# EAGLE board Open Book A1 Rev 01 (EAGLE 9.4.2)
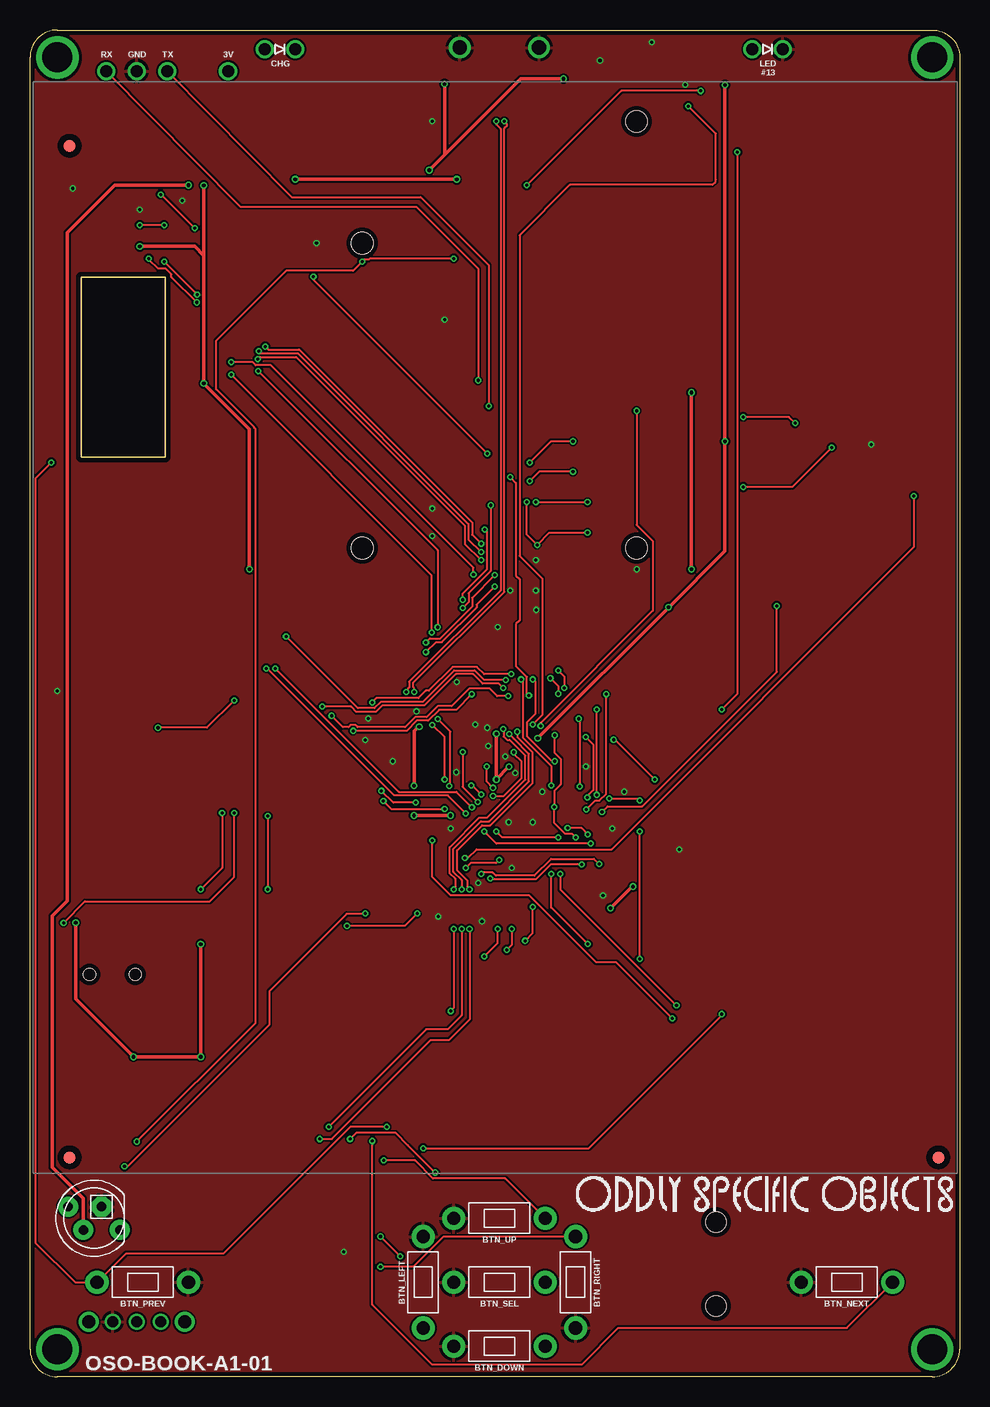
[diagram p2: board, top side]
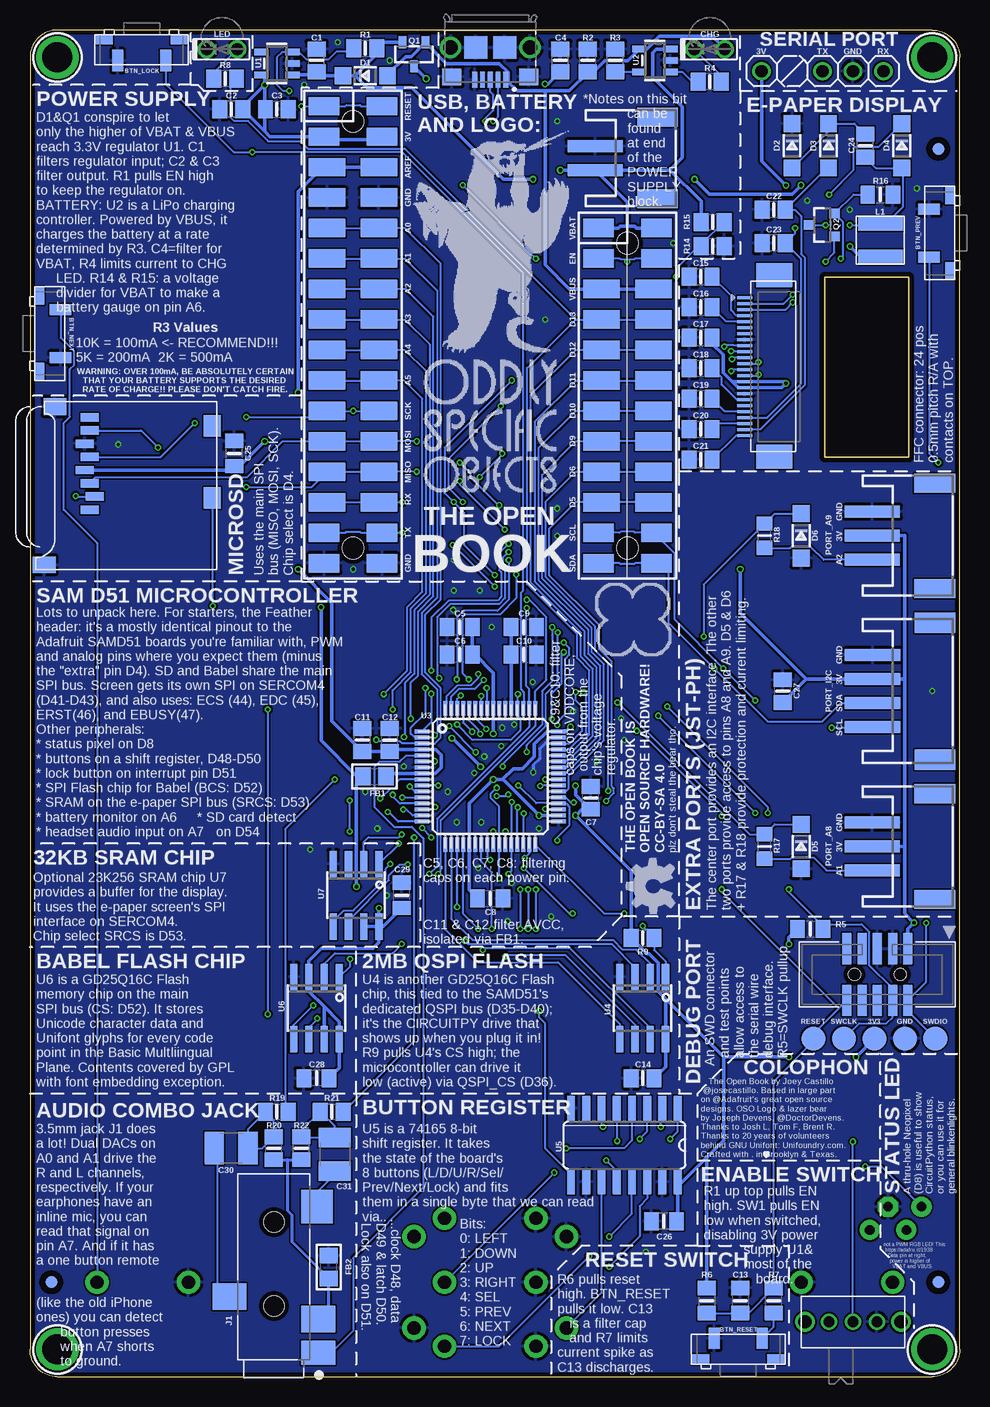
[diagram p3: board, bottom side, seen from below]

Size 77.47 x 112.27 mm. Coordinates in mm from the lower left corner, seen from the top.
Outline: 2.29,112.27 75.18,112.27 arc-90 77.47,109.98 77.47,2.29 arc-90 75.18,0 2.29,0 arc-90 0,2.29 0,109.98 arc-90 2.29,112.27
Copper layers (1*16): Top 0.035559375mm / dielectric 1.6mm / Bottom 0.035559375mm
Design rules "oshpark-2layer *": minimum track width 6mil, minimum drill 10mil, track to track 6mil, track to pad 6mil, pad to pad 6mil, via to via 6mil, smd to smd 6mil, copper to edge 15mil, drill to drill 6mil, minimum pad ring 5mil, minimum via ring 5mil, stop-mask expansion 2.5mil, vias tented up to drill 12mil, thermal gap 10mil
Net classes: 0 default: width 0.152 mm, drill 0.254 mm; 1 power: width 0.305 mm, drill 0.305 mm; 2 gnd: width 0.254 mm, drill 0.254 mm

## Footprints (pad centres in the part's own frame; a part is rotated, then mirrored left to right if it is on the bottom)
MJTP1250 = drill 1.1 pad 1.93: P$1 -2.54,0; P$2 5.08,0
TL3330AF130QG = smd 1.45 x 0.8: MP1 0.75,-2.1; MP2 7.05,-2.1 | smd 0.9 x 1.778: P$1 1.9,-0.346; P$2 5.9,-0.346
0805-NO = smd 1.24 x 1.5: 1 -0.95,0; 2 0.95,0
0805_10MGAP = smd 1.2 x 1.5: 1 -1.05,0; 2 1.05,0
C1210 = smd 1.6 x 2.7: 1 -1.4,0; 2 1.4,0
LED17X45_SIDEVIEW = drill 1: A -1.27,0; K 1.27,0
SOD-123 = smd 1.4 x 1.4: A 1.85,0; C -1.85,0
0805 = smd 1.3 x 1.5: 1 -0.95,0; 2 0.95,0
FIDUCIAL_1MM = smd 1 x 1: 1 0,0
CUI_SJ-43514-SMT = smd 2 x 2.8: 1 -7.15,-3.7 | smd 2.8 x 2.6: 2 5.05,-3.6 | smd 2.2 x 2.8: 3 -2.45,3.7; 4 -4.35,-3.7 | hole 1.7: -3.25,0; 3.75,0
FCI_10118193-0001LF = smd 0.4 x 1.35: 1 -1.3,2.675; 2 -0.65,2.675; 3 0,2.675; 4 0.65,2.675; 5 1.3,2.675 | smd 1.6 x 1.4: S1 -3.2,2.45; S2 3.2,2.45 | smd 1.9 x 1.9: S3 1.2,0; S4 -1.2,0 | drill 1.2: S5 3.302,0; S6 -3.302,0
1X03 = drill 1.016: 1 -2.54,0; 2 0,0; 3 2.54,0
1X01 = drill 1.016: 1 0,0
INDUCTOR_4X4MM_NR401 = smd 1.2 x 3.7: P$1 -1.4,0; P$2 1.4,0
MICROSD = smd 0.7 x 1.5: 1 9,-10.64; 2 7.9,-10.24; 3 6.8,-10.64; 4 5.7,-11.04; 5 4.6,-10.64; 6 3.5,-11.04; 7 2.4,-10.64; 8 1.3,-10.64 | smd 1.8 x 1.4: CD1 2,-0.44; CD2 8,-0.44 | smd 1.4 x 1.9: MT1 0.4,-13.54; MT2 13.6,-14.44
FEATHERWING_SMT2 = smd 1.524 x 2.54: 1 6.35,2.413; 1' 6.35,-2.413; 2 8.89,2.413; 2' 8.89,-2.413; 15 41.91,2.413; 15' 41.91,-2.413; 16 44.45,2.413; 16' 44.45,-2.413; 17 44.45,20.447; 17' 44.45,25.273; 18 41.91,20.447; 18' 41.91,25.273; 27 19.05,20.447; 27' 19.05,25.273; 28 16.51,20.447; 28' 16.51,25.273 | smd 1.524 x 3.048: 3 11.43,2.159; 3' 11.43,-2.159; 4 13.97,2.159; 4' 13.97,-2.159; 5 16.51,2.159; 5' 16.51,-2.159; 6 19.05,2.159; 6' 19.05,-2.159; 7 21.59,2.159; 7' 21.59,-2.159; 8 24.13,2.159; 8' 24.13,-2.159; 9 26.67,2.159; 9' 26.67,-2.159; 10 29.21,2.159; 10' 29.21,-2.159; 11 31.75,2.159; 11' 31.75,-2.159; 12 34.29,2.159; 12' 34.29,-2.159; 13 36.83,2.159; 13' 36.83,-2.159; 14 39.37,2.159; 14' 39.37,-2.159; 19 39.37,20.701; 19' 39.37,25.019; 20 36.83,20.701; 20' 36.83,25.019; 21 34.29,20.701; 21' 34.29,25.019; 22 31.75,20.701; 22' 31.75,25.019; 23 29.21,20.701; 23' 29.21,25.019; 24 26.67,20.701; 24' 26.67,25.019; 25 24.13,20.701; 25' 24.13,25.019; 26 21.59,20.701; 26' 21.59,25.019 | hole 1.8: 17.78,22.86; 43.18,22.86; 7.62,0; 43.18,0
JSTPH3 = smd 1 x 4.6: 1 -2,-2.7; 2 0,-2.7; 3 2,-2.7 | smd 1.6 x 3.4: NC1 -4.4,2.5; NC2 4.4,2.5
JSTPH4 = smd 1 x 4.6: 1 -3,-3.7; 2 -1,-3.7; 3 1,-3.7; 4 3,-3.7 | smd 1.7 x 3.4: NC1 -5.7,1.5; NC2 5.7,1.5
SOT23-R = smd 0.635 x 1.016: 1 -0.95,-1; 2 0.95,-1; 3 0,1
SOT23-3 = smd 0.8 x 0.9: 1 -0.95,-1; 2 0.95,-1; 3 0,1.1
_0805MP = smd 1.2 x 1.3: 1 -1.016,0; 2 1.016,0
LED5MMRGB = drill 0.8 pad 1.676: 1 -2.159,0.968; 3 0.889,0.968; 4 2.159,-0.968 | drill 0.8 pad 1.676 octagon: 2 -0.635,-0.968
A10767 = drill 1.1: MP1 -4,0; MP2 4,0 | drill 0.9: P$1 -2,0; P$2 0,0; P$3 2,0
TESTPOINT_ROUND_2MM_NO = smd 2 x 2: P$1 0,0
SOT23-5 = smd 0.55 x 1.2: 1 -0.95,-1.3; 2 0,-1.3; 3 0.95,-1.3; 4 0.95,1.3; 5 -0.95,1.3
TQFP64-10X10 = smd 1.2 x 0.3: 1 -5.7,3.75; 2 -5.7,3.25; 3 -5.7,2.75; 4 -5.7,2.25; 5 -5.7,1.75; 6 -5.7,1.25; 7 -5.7,0.75; 8 -5.7,0.25; 9 -5.7,-0.25; 10 -5.7,-0.75; 11 -5.7,-1.25; 12 -5.7,-1.75; 13 -5.7,-2.25; 14 -5.7,-2.75; 15 -5.7,-3.25; 16 -5.7,-3.75; 33 5.7,-3.75; 34 5.7,-3.25; 35 5.7,-2.75; 36 5.7,-2.25; 37 5.7,-1.75; 38 5.7,-1.25; 39 5.7,-0.75; 40 5.7,-0.25; 41 5.7,0.25; 42 5.7,0.75; 43 5.7,1.25; 44 5.7,1.75; 45 5.7,2.25; 46 5.7,2.75; 47 5.7,3.25; 48 5.7,3.75 | smd 0.3 x 1.2: 17 -3.75,-5.7; 18 -3.25,-5.7; 19 -2.75,-5.7; 20 -2.25,-5.7; 21 -1.75,-5.7; 22 -1.25,-5.7; 23 -0.75,-5.7; 24 -0.25,-5.7; 25 0.25,-5.7; 26 0.75,-5.7; 27 1.25,-5.7; 28 1.75,-5.7; 29 2.25,-5.7; 30 2.75,-5.7; 31 3.25,-5.7; 32 3.75,-5.7; 49 3.75,5.7; 50 3.25,5.7; 51 2.75,5.7; 52 2.25,5.7; 53 1.75,5.7; 54 1.25,5.7; 55 0.75,5.7; 56 0.25,5.7; 57 -0.25,5.7; 58 -0.75,5.7; 59 -1.25,5.7; 60 -1.75,5.7; 61 -2.25,5.7; 62 -2.75,5.7; 63 -3.25,5.7; 64 -3.75,5.7
SOIC8_150MIL = smd 0.6 x 2.2: 1 -1.905,-2.6; 2 -0.635,-2.6; 3 0.635,-2.6; 4 1.905,-2.6; 5 1.905,2.6; 6 0.635,2.6; 7 -0.635,2.6; 8 -1.905,2.6
SO16 = smd 0.66 x 2.032: 1 -4.445,-3.073; 2 -3.175,-3.073; 3 -1.905,-3.073; 4 -0.635,-3.073; 5 0.635,-3.073; 6 1.905,-3.073; 7 3.175,-3.073; 8 4.445,-3.073; 9 4.445,3.073; 10 3.175,3.073; 11 1.905,3.073; 12 0.635,3.073; 13 -0.635,3.073; 14 -1.905,3.073; 15 -3.175,3.073; 16 -4.445,3.073
MICROBUILDER_SOIC8_150MIL = smd 0.6 x 2.2: 1 -1.905,-2.6; 2 -0.635,-2.6; 3 0.635,-2.6; 4 1.905,-2.6; 5 1.905,2.6; 6 0.635,2.6; 7 -0.635,2.6; 8 -1.905,2.6
MOUNTINGHOLE_2.5_PLATED = drill 2.5 pad 3.2: P$1 0,0
EINK_DISPLAY_4_2IN = smd 1.25 x 0.275 bottom: 1 17.653,-16.717; 2 17.653,-17.217; 3 17.653,-17.717; 4 17.653,-18.217; 5 17.653,-18.717; 6 17.653,-19.217; 7 17.653,-19.717; 8 17.653,-20.217; 9 17.653,-20.717; 10 17.653,-21.217; 11 17.653,-21.717; 12 17.653,-22.217; 13 17.653,-22.717; 14 17.653,-23.217; 15 17.653,-23.717; 16 17.653,-24.217; 17 17.653,-24.717; 18 17.653,-25.217; 19 17.653,-25.717; 20 17.653,-26.217; 21 17.653,-26.717; 22 17.653,-27.217; 23 17.653,-27.717; 24 17.653,-28.217 | smd 3 x 2 bottom: SPRT1 15.193,-14.867; SPRT2 15.193,-29.977
JSTPH2 = smd 1 x 4.6: 1 -1,-3.7; 2 1,-3.7 | smd 1.6 x 3.4: NC1 -3.4,1.5; NC2 3.4,1.5
2X05_1.27MM_BOX_POSTS = smd 0.76 x 2.6: 1 -2.54,-2.15; 2 -2.54,2.15; 3 -1.27,-2.15; 4 -1.27,2.15; 5 0,-2.15; 6 0,2.15; 7 1.27,-2.15; 8 1.27,2.15; 9 2.54,-2.15; 10 2.54,2.15 | hole 1: -1.905,0; 1.905,0

## Placement (x,y rotation side)
BTN_DOWN  MJTP1250_SPST_SWITCH  [MJTP1250]  40.39,2.54 180 top
BTN_LEFT  MJTP1250_SPST_SWITCH  [MJTP1250]  32.77,6.6 90 top
BTN_LOCK  SPST_TACTILE_SWITCHRA  [TL3330AF130QG]  64.26,109.37 180 bottom
BTN_NEXT  MJTP1250_SPST_SWITCH  [MJTP1250]  69.34,7.87 180 top
BTN_NEXT_ALT  SPST_TACTILE_SWITCHRA  [TL3330AF130QG]  74.57,90.86 270 bottom
BTN_PREV  MJTP1250_SPST_SWITCH  [MJTP1250]  8.13,7.87 0 top
BTN_PREV_ALT  SPST_TACTILE_SWITCHRA  [TL3330AF130QG]  2.9,91.44 90 bottom
BTN_RESET  SPST_TACTILE_SWITCHRA  [TL3330AF130QG]  22.35,3.56 0 bottom
BTN_RIGHT  MJTP1250_SPST_SWITCH  [MJTP1250]  45.47,9.14 270 top
BTN_SEL  MJTP1250_SPST_SWITCH  [MJTP1250]  40.39,7.87 180 top
BTN_UP  MJTP1250_SPST_SWITCH  [MJTP1250]  40.39,13.21 180 top
C1  10µF  [0805-NO]  53.59,109.73 90 bottom
C2  10µF  [0805-NO]  60.71,105.66 180 bottom
C3  1uF  [0805-NO]  56.9,105.66 0 bottom
C4  10µF  [0805-NO]  33.27,109.73 90 bottom
C5  10uF  [0805_10MGAP]  41.66,62.48 180 bottom
C6  1uF  [0805_10MGAP]  41.66,60.2 180 bottom
C7  1uF  [0805-NO]  30.73,48.26 90 bottom
C8  1uF  [0805_10MGAP]  39.12,39.88 0 bottom
C9  10uF  [0805_10MGAP]  36.32,62.48 0 bottom
C10  1uF  [0805_10MGAP]  36.32,60.2 0 bottom
C11  10µF  [0805-NO]  49.78,53.09 90 bottom
C12  1uF  [0805-NO]  47.5,53.09 90 bottom
C13  0.1uF  [0805_10MGAP]  18.29,6.35 270 bottom
C14  1uF  [0805-NO]  26.42,24.89 180 bottom
C15  1uF  [0805-NO]  21.59,91.69 0 bottom
C16  1uF  [0805-NO]  21.59,89.15 0 bottom
C17  1uF  [0805-NO]  21.59,86.61 0 bottom
C18  1uF/25V  [0805-NO]  21.59,84.07 0 bottom
C19  1uF/25V  [0805-NO]  21.59,81.53 0 bottom
C20  1uF/25V  [0805-NO]  21.59,78.99 0 bottom
C21  1uF/25V  [0805-NO]  21.59,76.45 0 bottom
C22  1uF/25V  [0805-NO]  15.49,97.28 180 bottom
C23  1uF/25V  [0805-NO]  15.49,94.49 180 bottom
C24  4.7uF/25V  [0805-NO]  7.87,102.62 90 bottom
C25  10uF  [0805_10MGAP]  60.45,76.96 90 bottom
C26  1uF  [0805_10MGAP]  24.64,12.95 180 bottom
C27  10uF  [0805-NO]  14.73,57.15 90 bottom
C28  1uF  [0805_10MGAP]  53.59,24.89 180 bottom
C29  1uF  [0805_10MGAP]  46.48,40.13 90 bottom
C30  100uF  [C1210]  60.71,19.05 180 bottom
C31  100uF  [C1210]  52.07,18.54 270 bottom
CHG  AMBER  [LED17X45_SIDEVIEW]  20.83,110.67 180 bottom
D1  MBR120  [SOD-123]  49.53,108.46 0 bottom
D2  MBR0530  [SOD-123]  13.97,102.62 270 bottom
D3  MBR0530  [SOD-123]  10.92,102.62 270 bottom
D4  MBR0530  [SOD-123]  4.83,102.62 270 bottom
D5  3.6V  [SOD-123]  13.21,44.2 270 bottom
D6  3.6V  [SOD-123]  13.21,70.1 270 bottom
FB1  Ferrite  [0805]  48.77,50.04 0 bottom
FB2  Ferrite  [0805]  52.58,9.14 90 bottom
FID1  FIDUCIAL_1MM  [FIDUCIAL_1MM]  75.69,7.87 0 bottom
FID2  FIDUCIAL_1MM  [FIDUCIAL_1MM]  75.69,18.29 0 top
FID3  FIDUCIAL_1MM  [FIDUCIAL_1MM]  1.78,102.36 0 bottom
FID4  FIDUCIAL_1MM  [FIDUCIAL_1MM]  3.3,102.62 0 top
FID5  FIDUCIAL_1MM  [FIDUCIAL_1MM]  1.78,7.87 0 bottom
FID6  FIDUCIAL_1MM  [FIDUCIAL_1MM]  3.3,18.29 0 top
GOLD_ORB_SM1  OSHWLOGOLOGO5MM  [OSHW_5MM]  25.53,40.89 90 bottom
J1  SJ-43514-SMT  [CUI_SJ-43514-SMT]  57.15,9.14 90 bottom
J2  10118193-0001LF  [FCI_10118193-0001LF]  39.12,110.81 180 bottom
JP1  [1X03]  8.89,108.84 0 bottom
JP2  [1X01]  16.51,108.84 0 bottom
L1  68uH  [INDUCTOR_4X4MM_NR401]  6.6,94.74 270 bottom
LED  RED OR GRN  [LED17X45_SIDEVIEW]  61.47,110.67 180 bottom
MICROSD  MICROSD  [MICROSD]  61.85,81.28 270 bottom
MS1  FEATHERWING_SMTDUAL  [FEATHERWING_SMT2]  50.55,112.27 270 bottom
PORT_A8  JST PH 3  [JSTPH3]  4.57,44.2 270 bottom
PORT_A9  JST PH 3  [JSTPH3]  4.57,70.1 270 bottom
PORT_I2C  JST PH 4  [JSTPH4]  3.56,57.15 270 bottom
Q1  DMG341  [SOT23-R]  45.47,110.24 180 bottom
Q2  IRLML0100  [SOT23-3]  11.43,96.01 90 bottom
R1  10K  [0805-NO]  49.53,110.74 0 bottom
R2  100K  [0805-NO]  30.99,109.73 90 bottom
R3  10K\  [0805-NO]  28.7,109.73 90 bottom
R4  1K  [0805-NO]  20.83,107.95 180 bottom
R5  10K  [0805_10MGAP]  12.45,37.34 0 bottom
R6  10K  [0805_10MGAP]  21.08,6.35 270 bottom
R7  100  [0805_10MGAP]  15.49,6.35 90 bottom
R8  2.2K  [0805-NO]  61.21,108.2 180 bottom
R9  100K  [0805-NO]  26.42,36.58 0 bottom
R14  100K  [0805-NO]  20.57,94.23 0 bottom
R15  100K  [0805-NO]  20.57,96.27 0 bottom
R16  0.47ohm  [0805_10MGAP]  6.6,98.55 0 bottom
R17  1K  [_0805MP]  16.26,44.2 90 bottom
R18  1K  [_0805MP]  16.26,70.1 90 bottom
R19  100  [0805-NO]  56.9,22.1 0 bottom
R20  100  [0805-NO]  57.15,19.05 90 bottom
R21  100  [0805-NO]  52.32,22.1 0 bottom
R22  100  [0805-NO]  54.86,19.05 90 bottom
STATUS  WS2812B  [LED5MMRGB]  5.33,13.21 180 top
SW1  SPDT_SWITCH  [A10767]  8.89,4.57 0 bottom
TP1  [TESTPOINT_ROUND_2MM_NO]  4.57,28.19 180 bottom
TP2  [TESTPOINT_ROUND_2MM_NO]  7.11,28.19 180 bottom
TP6  [TESTPOINT_ROUND_2MM_NO]  9.65,28.19 180 bottom
TP7  [TESTPOINT_ROUND_2MM_NO]  2.03,28.19 180 bottom
TP8  [TESTPOINT_ROUND_2MM_NO]  12.19,28.19 180 bottom
U1  AP2112-3.3  [SOT23-5]  56.9,109.47 90 bottom
U2  MCP73831T-2ACI/OT  [SOT23-5]  25.4,109.73 90 bottom
U3  ATSAMD51J64-TQFP(10X10)  [TQFP64-10X10]  39.12,50.04 0 bottom
U4  GD25Q16C (or GD25Q32C)  [SOIC8_150MIL]  26.42,30.73 180 bottom
U5  74AC165D  [SO16]  27.94,19.3 180 bottom
U6  GD25Q16C (or GD25Q32C)  [MICROBUILDER_SOIC8_150MIL]  53.59,30.73 180 bottom
U7  23K256-I/SN  [SOIC8_150MIL]  50.29,40.13 180 bottom
U$1  MOUNTINGHOLE2.5  [MOUNTINGHOLE_2.5_PLATED]  2.29,2.29 0 bottom
U$2  WAVESHARE_4_2_INCH_EINK_DISPLAY  [EINK_DISPLAY_4_2IN]  0.25,106.68 0 top
U$4  MOUNTINGHOLE2.5  [MOUNTINGHOLE_2.5_PLATED]  75.18,2.29 0 bottom
U$5  MOUNTINGHOLE2.5  [MOUNTINGHOLE_2.5_PLATED]  2.29,109.98 0 bottom
U$7  MOUNTINGHOLE2.5  [MOUNTINGHOLE_2.5_PLATED]  75.18,109.98 0 bottom
U$44  OSO_GRAPHIC  [OSO_GRAPHIC]  27.18,63.12 0 bottom
U$45  OSO_BEAR  [OSO_BEAR_750MIL]  38.86,94.23 0 bottom
U$47  OSO_TEXT  [OSO_TEXT_435MIL]  39.12,78.82 0 bottom
U$48  OSO_TEXTOSO_TEXT_ONELINE_125MIL  [OSO_ONELINE_125MIL]  45.47,15.24 0 top
X1  JSTPH  [JSTPH2]  26.67,101.6 270 bottom
X2  2x5 0.05" SWD  [2X05_1.27MM_BOX_POSTS]  6.86,33.53 180 bottom

## Tracks (layer width: path | path; a pad name or v marks a point on that pad's centre or on a via)
!RESET  (via drill 0.25)
  Top 0.152: v41.88,54.36 42.67,55.14 42.67,66.55 40.79,68.43 40.79,95.15 45,99.35 56.86,99.35 57.14,99.64 57.14,99.81 57.15,99.82 57.15,103.63 v54.86,105.92 | v36.81,56.9 35.51,55.6 34.09,55.6 33.17,54.69 32.23,54.69 31.39,53.85 v26.92,53.85 | v19.81,46.74 v19.81,40.64
  Bottom 0.152: MS1.1 49.9,105.92 49.98,106 51.11,106 51.2,105.92 MS1.1' v54.86,105.92 | R6.2 C13.2 17.59,5.3 R7.2 15.49,24.64 12.19,27.94 TP8.P$1 12.19,28.58 X2.10 10.08,30.7 19.81,40.43 v19.81,40.64 | v41.88,54.36 40.61,53.09 37.41,53.09 36.63,53.87 36.63,54.91 36.87,55.15 U3.52 36.81,55.8 v36.81,56.9 | v26.92,53.85 26.67,53.85 19.81,46.99 v19.81,46.74
+3V3  (via drill 0.3)
  Top 0.305: v57.91,107.7 v57.91,77.98 57.91,68.83 v53.21,64.14 v42.32,53.24 | v14.22,36.07 v14.22,26.67 v8.64,26.67 3.81,31.5 v3.81,37.85 | v18.29,67.31 18.29,78.99 v14.48,82.8 14.48,93.47 | v9.14,94.23 13.72,94.23 14.48,93.47 | v39.91,50.86 38.86,49.81 v38.86,49.78 v38.86,53.59 | v32.44,54.18 32.33,54.18 32,53.85 v32,49.28 | v50.26,40.86 50.19,40.86 v48.39,39.06 | v32,46.79 v35.05,46.79 | v14.48,99.31 14.48,93.47
  Bottom 0.305: U1.5 57.91,108.24 v57.91,107.7 | v57.91,77.98 59.98,75.91 C25.1 60.78,75.58 MICROSD.4 | v38.86,53.59 U3.56 38.87,58.68 40.39,60.2 C6.1 C5.1 | U3.34 v35.05,46.79 38.05,49.78 38.1,49.78 | v53.21,64.14 53.21,53.02 50.23,50.04 FB1.1 49.72,49.84 50.26,49.29 v50.26,40.86 | 52.96,30.86 54.23,32.13 U6.3 54.23,34.67 53.21,35.69 48.89,35.69 48.39,36.2 U7.8 | 52.96,30.86 51.69,29.59 U6.8 51.69,25.75 C28.1 | U6.7 52.96,30.86 | 24.51,31.5 U4.8 24.51,25.85 C14.1 | 24.51,31.5 25.12,32.11 25.12,34.5 25.86,35.25 26.04,35.25 R9.1 27.37,42.15 v32,46.79 31.95,46.79 31.43,47.31 C7.1 30.8,47.31 32,48.51 v32,49.28 | 19.68,26.67 v14.22,26.67 | TP2.P$1 v8.64,26.67 | 24.51,31.5 19.68,26.67 | R5.1 14.22,36.61 v14.22,36.07 | X2.1 4.32,37.34 v3.81,37.85 4.59,38.62 4.59,44.2 | 4.59,44.2 4.59,58.17 | 4.59,58.17 4.59,70.1 PORT_A9.2 | C27.1 12.78,58.15 | 12.78,58.15 PORT_I2C.2 7.24,58.17 4.59,58.17 | PORT_A8.2 4.59,44.2 | 12.78,58.15 18.29,63.66 v18.29,67.31 | 18.96,82.96 18.46,82.46 U$2.16 14.82,82.46 v14.48,82.8 14.64,82.96 U$2.15 18.96,82.96 | C17.2 20.64,86.13 19.7,85.19 19.7,83.71 18.96,82.96 | v9.14,94.23 8.25,93.34 L1.P$2 | U7.8 v48.39,39.06 | U7.8 48.03,37.53 C29.1 | U7.7 U7.8 | v42.32,53.24 42.29,53.24 v39.91,50.86 | 38.1,49.78 37.21,50.67 36.45,50.67 35.43,51.69 35.43,52.73 34.38,53.79 U3.48 32.83,53.79 v32.44,54.18 | 19.68,26.67 19.68,19.69 21.08,18.29 | R6.1 21.08,18.29 | 38.1,49.78 v38.86,49.78 40.87,47.78 U3.21 40.87,40.58 C8.1 | JP2.1 16.51,101.35 v14.48,99.31 | v57.91,107.7 59.76,105.85 C2.1 57.91,103.82 | v57.91,107.7 57.91,105.73 | 57.91,105.73 C3.1 | 57.91,105.73 57.91,103.82 | U5.16 23.5,15.88 | 21.08,18.29 23.5,15.88
  Bottom 0.305: MS1.2 48.39,103.12 52.7,103.12 MS1.2' 57.47,103.38 57.91,103.82 | 23.5,15.88 23.5,13.05 C26.1
A0  (via drill 0.25)
  Top 0.152: v52.07,49.78 48.75,53.1 v48.63,53.1
  Bottom 0.152: MS1.5' MS1.5 46.23,95.76 43.24,92.78 43.24,64.81 44.52,63.53 44.52,58.69 43.24,57.42 43.24,53.27 43.73,52.79 U3.3 44.77,52.83 46.5,52.83 46.65,52.98 48.51,52.98 v48.63,53.1 | R19.2 56.2,22.35 56.2,45.65 v52.07,49.78
A1  (via drill 0.25)
  Top 0.152: v43.73,53.48 43.69,53.44 43.69,52.04 44.22,51.51 44.22,49.38 43.69,48.85 v43.69,47.5 43.69,46.16 44.59,45.25 45.17,45.25 v45.47,44.96
  Bottom 0.152: MS1.6' MS1.6 46.23,93.22 43.55,90.54 43.55,64.94 44.83,63.66 44.83,58.57 43.55,57.29 43.55,53.65 v43.73,53.48 | v43.69,47.5 43.9,47.29 U3.14 | R21.2 45.47,28.01 v45.47,44.96
A2  (via drill 0.25)
  Top 0.152: v45.73,54.85 45.82,54.76 v45.82,49.2
  Bottom 0.152: MS1.7' MS1.7 46.14,90.68 43.85,88.39 43.85,65.06 45.13,63.78 45.13,58.48 45.73,57.87 v45.73,54.85 | U3.11 45.41,48.79 v45.82,49.2
A3  (via drill 0.25)
  Top 0.152: v46.3,53.34 46.94,52.7 46.94,48.9 46.46,48.41 v46.46,48.28
  Bottom 0.152: MS1.8' MS1.8 46.23,88.14 44.16,86.07 44.16,65.19 45.44,63.91 45.44,58.6 46.23,57.81 46.23,53.42 v46.3,53.34 | v46.46,48.28 U3.12
A4  (via drill 0.25)
  Top 0.152: v47.24,48.51 v47.24,55.63
  Bottom 0.152: MS1.9' MS1.9 46.24,85.6 44.46,83.82 44.46,65.31 45.74,64.04 45.74,58.73 47.24,57.23 v47.24,55.63 | U3.13 46.64,47.79 47.24,48.39 v47.24,48.51
A5  (via drill 0.25)
  Top 0.152: v46.37,47.3 47.09,48.03 47.44,48.03 48.01,48.59 v48.01,56.9
  Bottom 0.152: MS1.10' MS1.10 46.29,83.06 44.77,81.53 44.77,65.44 46.04,64.16 46.04,58.86 v48.01,56.9 | U3.15 45.58,46.79 46.09,47.3 v46.37,47.3
A6_VMEAS  (via drill 0.25)
  Top 0.152: v41.58,56.8 41.4,56.98 41.4,58.34 40.49,59.26 40.49,62.74 40.79,63.04 40.79,66.5 40.49,66.8 40.49,74.5 v40,74.98 | v38.12,76.96 23.62,91.46 v23.62,91.69
  Bottom 0.152: U3.62 41.87,56.51 v41.58,56.8 | v40,74.98 38.12,76.87 v38.12,76.96 | v23.62,91.69 23.62,92.39 21.78,94.23 R14.1 21.52,94.41 19.67,96.27 R15.2
A7_MIC
  Bottom 0.152: J1.1 52.36,1.99 50.55,3.81 50.55,9.91 44.68,15.77 44.68,44.88 45.64,45.85 47.12,45.85 48.77,47.5 48.77,50.81 48.31,51.27 46.65,51.27 46.13,51.79 U3.5
A8_
  Bottom 0.152: R17.1 14.1,43.18 14,43.27 12.16,43.27 11.08,42.2 PORT_A8.3
A9_
  Bottom 0.152: R18.1 14.1,69.09 14,69.18 12.41,69.18 11.33,68.1 PORT_A9.3
AGND
  Bottom 0.254: R20.1 56.01,18.1 | 56.01,18.1 R22.1 | J1.4 52.58,5.67 FB2.1 55.63,11.24 55.63,13.46 56.01,13.84 56.01,18.1
AUDIO_LEFT
  Bottom 0.152: J1.2 53.55,15.41 52.07,16.89 C31.2
AUDIO_RIGHT
  Bottom 0.152: C30.2 61.87,18.81 61.87,7.71 J1.3
AVCC  (via drill 0.3)
  Top 0.305: v55.12,67.31 v55.12,82.04
  Bottom 0.305: FB1.2 47.57,50.29 U3.8 43.69,50.29 43.18,50.8 43.18,51.82 43.65,52.29 U3.4 47.35,52.29 C12.1 C11.1 52.32,54.68 52.32,64.52 v55.12,67.31 | MS1.3 MS1.3' 53.09,100.84 55.12,98.81 v55.12,82.04
BUTTON0
  Bottom 0.152: U5.11 29.85,6.99 BTN_LEFT.P$1
BUTTON1  (via drill 0.25)
  Top 0.152: BTN_UP.P$1 39.6,16.54 33.58,16.54 32.08,18.03 v29.46,18.03
  Bottom 0.152: v29.46,18.03 28.58,17.14 U5.12
BUTTON2  (via drill 0.25)
  Top 0.152: v30.86,10.03 v29.21,11.68
  Bottom 0.152: BTN_DOWN.P$1 38.35,2.54 v30.86,10.03 | v29.21,11.68 27.3,13.59 U5.13
BUTTON3  (via drill 0.25)
  Top 0.152: BTN_RIGHT.P$1 34.45,11.68 31.94,9.17 v29.21,9.17
  Bottom 0.152: U5.14 26.04,14.86 26.67,14.22 26.67,11.71 v29.21,9.17
BUTTON4  (via drill 0.25)
  Top 0.152: v33.78,17.02 31.5,19.3 30.48,20.32 27.18,20.32 v26.67,19.81
  Bottom 0.152: BTN_SEL.P$1 v33.78,17.02 | v26.67,19.81 26.04,20.45 U5.3
BUTTON5  (via drill 0.25)
  Top 0.152: v58.95,102.08 58.95,56.92 v57.66,55.63 | v57.66,30.23 57.66,30.14 46.57,19.05 v32.77,19.05
  Bottom 0.152: U3.51 36.32,55.78 36.32,57.1 36.54,57.31 36.54,65.36 36.37,65.53 36.37,91.99 46.46,102.08 v58.95,102.08 60.48,102.08 66.16,107.76 BTN_LOCK.P$1 | v57.66,55.63 v57.66,30.23 | U5.4 27.3,19.68 27.94,19.05 v32.77,19.05
BUTTON6  (via drill 0.25)
  Top 0.152: BTN_NEXT.P$1 68.07,4.06 49.02,4.06 45.97,1.02 33.53,1.02 28.54,6.01 v28.54,19.64
  Bottom 0.152: BTN_NEXT_ALT.P$1 74.92,86.62 73.8,85.5 73.8,84.33 74.14,83.99 74.14,80.01 74.68,79.48 74.68,72.28 71.88,69.49 BTN_NEXT.P$1 | v28.54,19.64 28.54,22.34 U5.5
BUTTON7  (via drill 0.25)
  Top 0.152: v1.78,76.2 0.46,74.88 0.46,11.18 3.76,7.87 BTN_PREV.P$1 8,10.29 16.13,10.29 26.67,20.83 v29.72,20.83
  Bottom 0.152: BTN_PREV_ALT.P$1 2.55,76.97 v1.78,76.2 | U5.6 29.85,20.95 v29.72,20.83
BUTTON_CLK  (via drill 0.25)
  Top 0.152: v39.95,53.57 40.31,53.21 40.31,53.19 41.58,51.91 41.58,49.63 38.25,46.3 37.57,46.3 35.28,44.01 35.28,42.09 35.97,41.41 v35.97,40.62 | v35.97,37.34 35.97,30.12 34.8,28.96 33.02,28.96 v24.89,20.83
  Bottom 0.152: U3.60 40.87,54.7 40.13,53.97 40.13,53.75 v39.95,53.57 | v35.97,40.62 v35.97,37.34 | v24.89,20.83 24.89,22.25 U5.2
BUTTON_LATCH  (via drill 0.25)
  Top 0.152: v40.61,53.77 40.61,53.31 41.88,52.04 41.88,49.51 38.35,45.97 37.67,45.97 35.59,43.89 35.59,42.22 36.45,41.35 36.45,40.79 v36.63,40.62 | v36.63,37.34 36.63,29.77 34.92,28.07 33.4,28.07 25.15,19.81 v24.13,19.81
  Bottom 0.152: U3.61 41.37,54.52 v40.61,53.77 | v36.63,40.62 v36.63,37.34 | v24.13,19.81 23.5,20.45 U5.1
BUTTON_OUT  (via drill 0.25)
  Top 0.152: v39.44,53.99 39.47,53.95 39.47,53.37 39.75,53.09 39.98,53.09 41.27,51.79 41.27,49.78 38.1,46.61 37.44,46.61 34.98,44.14 34.98,41.97 35.42,41.52 35.42,40.73 v35.31,40.62 | v35.31,37.34 35.31,30.73 v35.05,30.48
  Bottom 0.152: U3.59 40.37,54.91 v39.44,53.99 | v35.05,30.48 35.05,29.97 34.54,29.46 34.54,19.05 32.38,16.89 U5.9 | v35.31,40.62 v35.31,37.34
D2_A8  (via drill 0.25)
  Top 0.152: v40.11,58.57 37.85,58.57 37.24,59.18 35.23,59.18 33.23,57.19 32.98,57.19 32.37,56.58 28.87,56.58 v28.51,56.22
  Bottom 0.152: v40.11,58.57 40.11,58.27 40.72,57.66 41.83,57.66 42.74,56.75 42.74,55.86 U3.64 | v28.51,56.22 17.5,45.21 R17.2 15.42,46.05 D5.C
D3_A9  (via drill 0.25)
  Top 0.152: v39.65,58.09 37.85,58.09 37.06,58.88 35.35,58.88 32.74,56.26 29.23,56.26 28.7,55.73 27.33,55.73 v21.34,61.72
  Bottom 0.152: D6.C 15.42,71.95 R18.2 21.34,66.04 v21.34,61.72 | v39.65,58.09 40.39,57.35 41.71,57.35 42.37,56.69 U3.63
D5  (via drill 0.25)
  Top 0.152: v29.46,48 30.16,47.3 34.49,47.3 v34.54,47.35
  Bottom 0.152: MS1.19' MS1.19 32,72.9 34.19,70.71 34.19,66.8 30.05,62.66 30.05,60.66 29.01,59.62 29.01,49.25 28.81,49.05 28.81,48.65 v29.46,48 | U3.35 34.48,47.29 v34.54,47.35
D6  (via drill 0.25)
  Top 0.152: v32.14,47.87 30.27,47.87 v29.29,48.85
  Bottom 0.152: MS1.20' MS1.20 32,75.44 34.49,72.95 34.49,66.68 30.35,62.54 30.35,60.54 29.32,59.5 29.32,48.87 v29.29,48.85 | U3.37 32.84,48.29 32.42,47.87 v32.14,47.87
D8_NEOPIX  (via drill 0.25)
  Top 0.152: v27.94,38.61 27.92,38.58 26.39,38.58 19.94,32.13 19.94,29.34 8.13,17.53 v7.87,17.53
  Bottom 0.152: U3.32 29.64,38.61 v27.94,38.61 | v7.87,17.53 6.53,17.53 STATUS.4
D9
  Bottom 0.152: U3.38 32.84,48.79 32.59,49.04 32.59,50.1 29.64,53.05 29.64,59.39 30.66,60.41 30.66,62.41 34.8,66.55 34.8,75.18 32,77.98 MS1.21 MS1.21'
D10
  Bottom 0.152: MS1.22' MS1.22 32,80.52 35.1,77.42 35.1,66.42 30.96,62.28 30.96,60.28 29.95,59.27 29.95,53.17 32.83,50.29 U3.41
D11
  Bottom 0.152: MS1.23' MS1.23 31.95,83.06 35.41,79.6 35.41,66.3 31.27,62.16 31.27,60.16 30.25,59.14 30.25,53.3 32.77,50.79 U3.42
D12
  Bottom 0.152: MS1.24' MS1.24 32,85.6 35.74,81.86 35.74,66.19 31.57,62.03 31.57,60.03 30.56,59.02 30.56,53.43 32.7,51.29 U3.43
D13
  Bottom 0.152: MS1.25' MS1.25 32,88.14 | U3.44 32.63,51.78 30.86,53.55 30.86,58.89 31.88,59.91 31.88,61.9 36.04,66.07 36.04,84.1 32,88.14 | 32,88.14 46.25,102.39 54.32,102.39 54.93,103 57.63,103 59.32,104.69 60.47,104.69 60.77,104.99 60.77,107.7 R8.1
EINK_BUSY  (via drill 0.25)
  Top 0.152: v19.6,85.88 19.86,85.62 22.43,85.62 36.84,71.21 36.84,70.19 v37.59,69.44 | v44.02,58.87 44.52,58.37 v44.52,57.42
  Bottom 0.152: U$2.9 18.84,85.96 18.85,85.98 19.5,85.98 v19.6,85.88 | v37.59,69.44 38.38,68.65 38.38,67.24 38.2,67.06 38.2,65.02 38.5,64.73 42.57,64.73 44.02,63.28 v44.02,58.87 | v44.52,57.42 44.52,55.31 45.72,54.1 45.72,53.59 45.47,53.34 44.87,53.34 U3.2
EINK_CS  (via drill 0.25)
  Top 0.152: v43.43,49.28 43.43,50.93 41.1,53.27 41.1,57.96 v40.92,58.14 | v16.76,84.58 18.54,84.58 18.81,84.32 20.08,84.32 36.96,67.44 v36.96,66.88
  Bottom 0.152: v43.43,49.28 44.8,49.28 U3.10 | U$2.12 16.88,84.46 v16.76,84.58 | v40.92,58.14 41.43,58.66 41.43,63.33 41.21,63.56 38.3,63.56 36.96,64.9 v36.96,66.88
EINK_DC  (via drill 0.25)
  Top 0.152: v43.74,51.31 43.51,51.31 41.4,53.42 41.4,54.56 42.11,55.27 42.11,57.94 v41.91,58.14 | v18.97,84.84 19.15,85.01 22.17,85.01 36.23,70.95 36.23,69.43 v37.59,68.07
  Bottom 0.152: U3.6 43.76,51.29 v43.74,51.31 | U$2.11 18.92,84.96 18.97,84.92 v18.97,84.84 | v41.91,58.14 41.88,58.17 41.88,63.32 41.33,63.86 38.5,63.86 37.59,64.77 v37.59,68.07
EINK_MISO  (via drill 0.25)
  Top 0.152: v38.86,45.47 39.37,44.96 v44.03,44.96 | v46.48,45.21 45.96,45.73 v44.79,45.73
  Bottom 0.152: U7.2 49.66,44.58 49.28,44.96 46.74,44.96 v46.48,45.21 | v38.86,45.47 v38.87,45.46 U3.25 | v44.79,45.73 v44.03,44.97 v44.03,44.96
EINK_MOSI  (via drill 0.25)
  Top 0.152: v47.44,42.73 46.99,43.18 43.43,43.18 42.02,41.77 38.82,41.77 38.55,42.04 37.72,42.04 v37.59,41.91 | v16.76,83.52 33.45,66.83 33.45,62.05 v33.48,62.02 | v36.07,52.07 36.05,52.06 36.05,49.18 v37.32,47.91
  Bottom 0.152: U$2.14 16.82,83.46 v16.76,83.52 | U7.5 52.2,37.98 51.32,38.86 50.53,38.86 47.86,41.54 47.86,42.32 47.45,42.73 v47.44,42.73 | v33.48,62.02 33.48,57.91 34.49,56.9 34.49,54.23 36.07,52.65 v36.07,52.07 | v37.32,47.91 37.36,47.87 U3.28 37.37,42.14 v37.59,41.91
EINK_RST  (via drill 0.25)
  Top 0.152: v19.05,85.5 19.23,85.32 22.3,85.32 36.54,71.08 36.54,69.81 v37.59,68.75 | v43.37,58.23 44.03,57.57 v44.03,56.94
  Bottom 0.152: U$2.10 19.02,85.46 v19.05,85.5 | v37.59,68.75 38.07,68.27 38.07,67.36 37.9,67.19 37.9,64.9 38.37,64.42 42.44,64.42 43.53,63.33 43.53,58.39 v43.37,58.23 | v44.03,56.94 44.03,54.57 U3.1
EINK_SCK  (via drill 0.25)
  Top 0.152: v45.97,42.7 43.38,42.7 42.15,41.46 38.45,41.46 v38.35,41.55 | v19.04,83.83 33.96,68.91 v33.96,62.48 | v38.58,49.1 38.07,49.61 v38.07,50.86
  Bottom 0.152: U7.6 50.93,38.04 47.55,41.41 47.55,41.8 46.66,42.7 v45.97,42.7 | v38.35,41.55 38.37,41.56 U3.26 38.37,47.53 39.06,48.23 39.06,48.63 38.78,48.91 38.77,48.91 v38.58,49.1 | U$2.13 18.91,83.96 v19.04,83.83 | v33.96,62.48 33.96,62.23 33.96,61.83 33.96,61.82 33.96,57.99 34.8,57.15 34.8,54.37 38.07,51.09 v38.07,50.86
EN  (via drill 0.25)
  Top 0.152: v8.89,19.6 18.8,29.51 18.8,78.99 18.67,79.12 18.67,79.15 15.51,82.31 15.51,86.36 21.34,92.19 26.92,92.19 v27.69,92.95 27.86,93.13 28.25,93.13 28.34,93.22 v35.31,93.22 | v55.88,107.19 49.28,107.19 v41.4,99.31
  Bottom 0.152: v41.4,99.31 v35.31,93.22 | SW1.P$2 v8.89,19.6 | v27.69,92.95 v27.69,92.96 | v27.69,92.96 27.86,93.13 28.25,93.13 28.34,93.22 MS1.27 | MS1.27' 27.04,93.22 27.12,93.13 27.52,93.13 v27.69,92.96 | R1.1 50.73,110.49 51.92,110.49 52.58,109.83 54.44,109.83 55.03,110.42 U1.3 56.45,110.42 56.9,109.98 56.9,107.7 56.39,107.19 v55.88,107.19
GDR  (via drill 0.25)
  Top 0.152: v13.92,90.22 v11.18,92.96
  Bottom 0.152: v13.92,90.22 14.68,89.46 U$2.2 | v11.18,92.96 10.43,93.71 Q2.1
GND  (via drill 0.25)
  Bottom 0.254: v35.53,50.39 35.53,50.98 35,51.51 35,52.35 34.06,53.29 U3.47
  other vias: 26.16,10.41 27.94,53.09 30.23,51.31 28.19,54.86 35.56,57.91 35.05,45.72 37.67,37.97 34.04,38.35 37.34,41.15 40.13,42.42 38.1,54.1 38.2,52.58 39.6,51.71 40.44,50.32 39.88,46.23 42.67,48.77 41.91,46.23 47.75,40.13 70.1,77.72 50.55,67.31 42.19,63.93 42.16,65.53 42.16,68.07 40,65.53 38.99,62.48 32.21,55.47 46.33,50.88 33.53,104.65 34.54,88.14 48.51,45.72 49.53,48.77 54.1,43.94 33.53,72.39 33.53,70.08 37.11,54.36 51.82,111.25 54.61,107.7 47.5,109.73 3.56,99.06 9.14,97.28 12.7,98.04 2.29,57.15 23.88,94.49
  pour Bottom: 86.61,112.78 0.76,112.78 -2.29,109.73 -2.29,1.27 0.76,-1.78 81.79,-1.78 86.61,3.05
  pour Top: 88.39,111.51 85.85,114.05 -0.25,114.05 -4.06,110.24 -4.06,-3.03 81.81,-3.03 88.39,3.56
MISO  (via drill 0.25)
  Top 0.152: v46.48,36.07 43.43,39.12 v43.43,41.91 | v66.8,77.47 63.5,74.17 v59.44,74.17 | v37.9,70.61 38.07,70.43 38.07,67.29 36.06,65.28 v36.06,64.77 | v45.25,75.44 42.42,75.44 v41.66,74.68
  Bottom 0.152: U6.2 52.96,34.42 52.07,35.31 47.24,35.31 v46.48,36.07 | v43.43,41.91 43.24,42.1 43.24,46.37 35.37,54.25 U3.49 35.37,57.16 34.44,58.08 34.44,63.33 35.88,64.77 v36.06,64.77 | MICROSD.7 68.21,78.88 v66.8,77.47 | v59.44,74.17 53.97,74.17 MS1.13' MS1.13 v45.25,75.44 | v41.66,74.68 41.66,74.37 v37.9,70.61
MOSI  (via drill 0.25)
  Top 0.152: v44.2,41.91 44.2,40.64 v53.87,30.96 | v36.06,64.09 36.54,64.57 36.54,65.33 38.38,67.17 v38.38,72.64 | v41.66,76.2 43.43,77.98 v45.25,77.98
  Bottom 0.152: v44.2,41.91 43.55,42.56 43.55,46.5 35.87,54.18 U3.50 35.87,57.34 36.11,57.59 36.11,64.04 v36.06,64.09 | U6.5 55.5,29.34 v53.87,30.96 | MICROSD.3 71.98,74.99 59.38,74.99 56.39,77.98 MS1.12' MS1.12 v45.25,77.98 | v38.38,72.64 38.46,72.64 40.79,74.98 40.79,75.34 v41.66,76.2
N$1
  Bottom 0.152: BTN_RESET.P$2 15.49,4.17 R7.1
N$2
  Bottom 0.152: D2.A 10.92,103.81 D3.C 8.77,104.47 C24.2
N$3  (via drill 0.25)
  Top 0.152: v11.18,96.01 v9.14,96.01
  Bottom 0.152: C24.1 6.97,100.77 D4.A 4.72,100.67 4.72,97.51 6.1,96.14 L1.P$1 6.6,96.01 v9.14,96.01 | Q2.3 v11.18,96.01
N$4
  Bottom 0.152: R4.1 19.88,108.45 CHG.K
N$5
  Bottom 0.152: U2.1 23.11,108.78 22.29,107.95 R4.2
N$7
  Bottom 0.152: R8.2 62.16,108.7 LED.A
N$15
  Bottom 0.152: R22.2 54.81,19.94 | 54.81,19.94 C31.1 52.07,20.89 R21.1 54.81,20.57 54.81,19.94
N$70
  Bottom 0.152: C30.1 58.1,19.05 R20.2 57.15,21.4 R19.1 59.31,20.64 C30.1
PREVGH  (via drill 0.25)
  Top 0.152: v13.72,95.76 10.92,98.55 v10.88,98.55
  Bottom 0.152: D4.C 6.78,102.52 8.72,102.52 8.85,102.38 8.85,100.58 v10.88,98.55 | U$2.21 16.05,79.96 13.21,82.8 13.21,93.15 C23.1 13.72,95.32 v13.72,95.76
PREVGL
  Bottom 0.152: D3.A 11.06,100.77 C22.1 13.76,97.28 13.21,96.73 13.21,93.59 12.9,93.28 12.9,82.68 16.62,78.96 U$2.23
PROG
  Bottom 0.152: R3.1 U2.5
QSPI_CS  (via drill 0.25)
  Top 0.152: v39.1,43.09 38.84,42.82 36.73,42.82 v36.32,42.42 | v26.42,37.59 31.24,37.59 v32.26,38.61
  Bottom 0.152: v26.42,37.59 26.42,37.53 R9.2 25.47,35.56 24.51,34.6 U4.1 | U3.24 39.37,43.35 v39.1,43.09 | v36.32,42.42 32.51,38.61 v32.26,38.61
QSPI_DATA[0]
  Bottom 0.152: U4.5 28.32,29.4 33.46,34.54 40.13,34.54 42.87,37.28 U3.17
QSPI_DATA[1]
  Bottom 0.152: U4.2 25.76,33.35 25.76,34.43 26.93,35.6 28.08,35.6 28.88,36.4 40.59,36.4 42.37,38.17 U3.18
QSPI_DATA[2]  (via drill 0.25)
  Top 0.152: v41.25,36.35 41.88,36.98 v41.88,39.17
  Bottom 0.152: U4.3 27.03,33.35 27.03,34.1 29,36.07 40.97,36.07 v41.25,36.35 | v41.88,39.17 41.88,44.32 U3.19
QSPI_DATA[3]  (via drill 0.25)
  Top 0.152: v40.13,37.34 40.13,35.99 v39.73,35.59
  Bottom 0.152: U4.7 25.71,28.2 25.71,29 32.47,35.76 39.55,35.76 v39.73,35.59 | U3.20 41.4,44.3 41.4,38.61 v40.13,37.34
QSPI_SCK  (via drill 0.25)
  Top 0.152: v37.85,35.05 38.98,36.18 v38.98,37.34
  Bottom 0.152: U4.6 27.03,28.16 27.03,29.33 32.85,35.15 37.74,35.15 v37.85,35.05 | v38.98,37.34 38.98,42.05 39.88,42.95 39.88,44.33 U3.23
RESE  (via drill 0.25)
  Top 0.152: v13.9,89.56 11.78,91.68 11.78,91.9 11.29,92.38 10.67,92.38 9.91,93.14 v9.91,93.22
  Bottom 0.152: v13.9,89.56 14.49,88.96 U$2.3 | R16.1 8.84,98.55 Q2.2 9.75,96.28 9.75,93.37 v9.91,93.22
RX  (via drill 0.25)
  Top 0.152: v34.54,49.78 34.54,53.32 v33.52,54.35 | v33,61.21 33.32,61.54 34.2,61.54 36.85,64.19 36.85,64.93 v38.73,66.82 | v42.16,72.9 v46.46,72.9 | JP1.3 17.53,97.54 32.18,97.54 37.34,92.38 v37.34,83.06
  Bottom 0.152: MS1.14' MS1.14 v46.46,72.9 | U3.40 v34.54,49.79 v34.54,49.78 | v33.52,54.35 33.52,54.6 32.87,55.25 32.87,59.84 32.51,60.2 32.51,60.73 v33,61.21 | v38.73,66.82 41.27,69.35 41.27,72 v42.16,72.9 42.93,73.66 42.93,77.47 v37.34,83.06
SCK  (via drill 0.25)
  Top 0.152: v53.52,29.88 48.85,34.54 47.19,34.54 41.6,40.13 35.05,40.13 33.53,41.66 v33.53,44.7 | v63.75,79.5 63.25,80.01 v59.44,80.01 | v40.32,52.06 40.32,51.93 40.97,51.29 40.97,49.91 39.49,48.43 v38.58,48.43 | v37.62,48.55 36.87,49.3 v36.78,49.3 | v50.55,80.52 50.55,71.01 51.9,69.65 51.9,63.87 42.54,54.51 v42.54,54.26
  Bottom 0.152: MS1.11 v50.55,80.52 MS1.11' 53.21,80.01 v59.44,80.01 | U6.6 54.23,29.08 53.52,29.79 v53.52,29.88 | v33.53,44.7 33.53,44.96 32.51,45.98 32.51,47.5 32.8,47.79 U3.36 34.3,47.79 34.34,47.83 35.3,47.83 v36.78,49.3 | MICROSD.5 66.58,76.68 v63.75,79.5 | v42.54,54.26 40.35,52.06 v40.32,52.06 | v38.58,48.43 37.74,48.43 v37.62,48.55
SCL  (via drill 0.25)
  Top 0.152: v17.02,56.39 14.73,54.1 v10.67,54.1 | v36.32,46.97 34.82,48.46 30.36,48.46 19.77,59.05 v19.69,59.05
  Bottom 0.152: MS1.18 28.34,70.36 28.25,70.44 27.12,70.44 27.04,70.36 MS1.18' 25.27,70.17 23.77,68.67 23.77,63.14 v19.69,59.05 v17.02,56.39 | v10.67,54.1 7.3,54.1 PORT_I2C.4 | v36.32,46.97 36.37,46.97 U3.30
SD_CD  (via drill 0.25)
  Top 0.152: v47.66,47.08 48.13,47.54 51.02,47.54 62.23,58.75 v62.23,64.26
  Bottom 0.152: U3.16 46.8,46.29 47.59,47.08 v47.66,47.08 | v62.23,64.26 62.23,73.22 MICROSD.CD2
SDA  (via drill 0.25)
  Top 0.152: v36.83,47.47 35.53,48.77 30.73,48.77 v20.45,59.05
  Bottom 0.152: MS1.17 28.34,67.82 28.25,67.73 27.12,67.73 27.04,67.82 MS1.17' 25.02,67.82 24.28,67.08 24.28,62.89 v20.45,59.05 16,54.61 11.43,54.61 9.89,56.15 PORT_I2C.3 | U3.29 36.87,47.47 v36.83,47.47
SDCS  (via drill 0.25)
  Top 0.152: v36.25,43.26 36.5,43.26 37.21,43.97 48.46,43.97 73.66,69.17 v73.66,73.41
  Bottom 0.152: U3.31 35.87,43.64 v36.25,43.26 | v73.66,73.41 73.63,73.38 MICROSD.2
SRAM_CS  (via drill 0.25)
  Top 0.152: v37.85,45.47 38.86,44.45 v46.74,44.45
  Bottom 0.152: U7.1 46.74,44.38 v46.74,44.45 | U3.27 37.85,44.32 v37.85,45.47
SWCLK  (via drill 0.25)
  Top 0.152: v39.42,57.43 39.07,57.78 37.72,57.78 36.93,58.57 35.48,58.57 32.86,55.96 29.36,55.96 28.83,55.42 27.2,55.42 26.77,55.86 v24.37,55.86 | v16,46.99 16,42.42 v14.22,40.64
  Bottom 0.152: TP6.P$1 8.38,29.46 6.1,29.46 5.59,29.97 X2.4 5.59,32.37 7.52,34.3 7.52,37.07 8.16,37.72 11.02,37.72 R5.2 11.4,37.59 14.22,40.42 v14.22,40.64 | U3.57 39.37,57.37 v39.42,57.43 | v24.37,55.86 16,47.5 v16,46.99
SWDIO  (via drill 0.25)
  Top 0.152: v39.85,56.74 38.93,56.74 38.3,57.38 36.61,57.38 35.13,55.91 33.96,55.91 33.05,54.99 32.1,54.99 31.26,54.15 27.3,54.15 27.12,54.33 26.72,54.33 26.55,54.15 26.08,54.15 v25.13,55.1 | v2.79,37.85 4.57,39.62 14.99,39.62 17.02,41.66 v17.02,46.99
  Bottom 0.152: TP7.P$1 4.32,30.48 X2.2 2.79,32.9 v2.79,37.85 | U3.58 39.87,56.73 v39.85,56.74 | v25.13,55.1 v17.02,46.99
TX  (via drill 0.25)
  Top 0.152: v34.95,49.25 35.03,49.33 35.03,53.77 v33.99,54.81 | v33,60.4 33.84,61.24 34.32,61.24 37.21,64.12 37.21,64.36 v38.73,65.88 | v46.46,70.36 43.27,70.36 v42.25,69.34 41.4,70.19 v41.4,72.9 | JP1.1 21.79,98.35 32.56,98.35 38.23,92.68 v38.23,80.9
  Bottom 0.152: MS1.15' 51.2,70.36 51.11,70.44 49.98,70.44 49.9,70.36 MS1.15 v46.46,70.36 | U3.39 34.91,49.29 v34.95,49.25 | v33.99,54.81 33.99,56.97 33.17,57.79 33.17,60.22 v33,60.4 | v42.25,69.34 42.19,69.34 v38.73,65.88 | v38.23,80.9 42.62,76.5 42.62,74.12 v41.4,72.9
UNIFONT_CS  (via drill 0.25)
  Top 0.152: v50.8,34.82 50.8,45.45 v50.82,45.47 | v50.82,48.03 50.66,48.19 v48.28,48.19
  Bottom 0.152: U6.1 50.8,34.22 v50.8,34.82 | U3.9 46.69,49.79 46.94,49.54 46.94,49.19 47.07,49.06 47.42,49.06 v48.28,48.19 | v50.82,45.47 v50.82,48.03
USB_N  (via drill 0.25)
  Top 0.152: v31.34,57.07 31.34,57.23 31.6,57.48 31.6,57.94 39.22,65.56 39.22,104.04 38.86,104.39 v38.86,104.65
  Bottom 0.152: U3.45 32.56,52.29 31.17,53.68 31.17,56.9 v31.34,57.07 | J2.2 38.47,105.04 v38.86,104.65
USB_P  (via drill 0.25)
  Top 0.152: v32,57.07 32,57.4 31.9,57.51 31.9,57.81 39.52,65.43 39.52,104.06 39.73,104.27 39.73,104.44 v39.52,104.65
  Bottom 0.152: U3.46 32.51,52.79 31.47,53.83 31.47,55.85 32,56.39 v32,57.07 | J2.3 39.12,107.11 38.86,106.85 38.86,105.57 39.52,104.91 v39.52,104.65
V+  (via drill 0.3)
  Top 0.305: v35.56,99.82 v22.1,99.82 | v13.22,99.33 13.21,99.31 7.05,99.31 3.1,95.37 3.1,39.67 1.84,38.42 1.84,17.46 4.45,14.86 STATUS.3
  Bottom 0.305: Q1.2 48.09,111.24 R1.2 48.58,110.24 50.36,108.46 | U1.1 53.85,108.52 C1.1 53.27,108.46 D1.C 50.36,108.46 | 50.36,108.46 49.35,107.44 45.67,107.44 38.05,99.82 v35.56,99.82 | v22.1,99.82 20.87,98.59 13.95,98.59 v13.22,99.33
VBAT  (via drill 0.3)
  Top 0.305: v33.27,100.58 34.54,101.85 | 34.54,101.85 v34.54,107.77 | 34.54,101.85 40.89,108.2 v44.45,108.2
  Bottom 0.305: MS1.28' 26.93,95.76 27.09,95.92 27.69,95.92 | 27.69,95.92 28.28,95.92 28.44,95.76 MS1.28 | 27.69,95.92 27.69,97.92 X1.2 | X1.2 24.15,100.6 | R15.1 21.52,97.98 24.15,100.6 | 24.15,100.6 23.11,101.63 23.11,105.89 25.55,108.33 25.55,110.39 25.27,110.68 U2.3 | X1.2 33.26,100.6 v33.27,100.58 | v34.54,107.77 34.28,107.77 C4.1 | v44.45,108.2 45.47,109.22 Q1.3
VBUS
  Bottom 0.305: J2.1 37.61,107.93 | 37.61,107.93 36.87,107.19 34.54,107.19 | 34.54,107.19 32.51,107.19 30.99,108.71 R2.1 30.5,108.78 29.58,109.7 27.68,109.7 U2.4 26.09,110.68 25.04,111.73 20.62,111.73 CHG.A | 37.61,107.93 37.61,108.73 38.35,109.47 42.79,109.47 43.62,110.31 43.62,110.34 Q1.1 45.69,110.06 46.15,110.06 47.68,108.53 D1.A | 34.54,107.19 34.54,92.71 32.51,90.68 MS1.26 MS1.26'
VCOM
  Bottom 0.152: U$2.24 18.63,78.46 C21.2
VDD
  Bottom 0.152: U$2.18 17.93,81.44 18.57,81.44 19.84,82.7 19.84,83.27 C18.2
VDDCORE2
  Bottom 0.305: U3.53 C10.1 C9.1
VGH
  Bottom 0.152: U$2.5 19.45,87.96 C16.2
VGL
  Bottom 0.152: U$2.4 18.61,88.46 19.05,88.9 19.05,90.1 C15.2
VSH
  Bottom 0.152: U$2.20 19.57,80.46 C19.2
VSL
  Bottom 0.152: U$2.22 20.17,79.46 C20.2

## Text on the board
tPlace: RX | GND | TX | 3V | CHG | LED / #13 | BTN_UP | BTN_LEFT | BTN_RIGHT | BTN_PREV | BTN_SEL | BTN_NEXT | OSO-BOOK-A1-01 | BTN_DOWN
bPlace: SERIAL PORT | RX | GND | TX | 3V | BTN_LOCK | E-PAPER DISPLAY | *Notes on this bit / can be / found / at end / of the / POWER / SUPPLY / block. | USB, BATTERY / AND LOGO: | POWER SUPPLY | RESET | D1&Q1 conspire to let / only the higher of VBAT & VBUS / reach 3.3V regulator U1. C1 / filters regulator input; C2 & C3 / filter output. R1 pulls EN high / to keep the regulator on. / BATTERY: U2 is a LiPo charging / controller. Powered by VBUS, it / charges the battery at a rate / determined by R3. C4=filter for / VBAT, R4 limits current to CHG / LED. R14 & R15: a voltage / divider for VBAT to make a / battery gauge on pin A6. | 3V | AREF | GND | VBAT | A0 | BTN_PREV | EN | A1 | VBUS | A2 | D13 | A3 | R3 Values | 10K = 100mA <- RECOMMEND!!! / 5K = 200mA 2K = 500mA | BTN_NEXT | D12 | A4 | D11 | A5 | WARNING: OVER 100mA, BE ABSOLUTELY CERTAIN / THAT YOUR BATTERY SUPPORTS THE DESIRED / RATE OF CHARGE!! PLEASE DON'T CATCH FIRE. | D10 | SCK | D9 | MOSI | FFC connector: 24 pos / 0.5mm pitch R/A with / contacts on TOP. | D6 | MISO | D5 | THE OPEN | RX | GND | 3V | SCL | BOOK | TX | A2 | SDA | GND | Uses the main SPI / bus (MISO, MOSI, SCK). / Chip select is D4. | MICROSD | SAM D51 MICROCONTROLLER | Lots to unpack here. For starters, the Feather / header: it's a mostly identical pinout to the / Adafruit SAMD51 boards you're familiar with, PWM / and analog pins where you expect them (minus / the "extra" pin D4). SD and Babel share the main / SPI bus. Screen gets its own SPI on SERCOM4 / (D41-D43), and also uses: ECS (44), EDC (45), / ERST(46), and EBUSY(47). / Other peripherals: / * status pixel on D8 / * buttons on a shift register, D48-D50 / * lock button on interrupt pin D51 / * SPI Flash chip for Babel (BCS: D52) / * SRAM on the e-paper SPI bus (SRCS: D53) / * battery monitor on A6 * SD card detect / * headset audio input on A7 on D54 | GND | 3V | SDA | SCL | C9&C10: filter | caps on VDDCORE, / output from the / chip's voltage / regulator. | GND | 3V | plz don't steal the bear tho. | THE OPEN BOOK IS / OPEN SOURCE HARDWARE! / CC-BY-SA 4.0 | 32KB SRAM CHIP | C5, C6, C7, C8: filtering / caps on each power pin. | A1 | Optional 23K256 SRAM chip U7 / provides a buffer for the display. / It uses the e-paper screen's SPI / interface on SERCOM4. / Chip select SRCS is D53. | The center port provides an I2C interface. The other / two ports provide access to pins A8 and A9. D5 & D6 / + R17 & R18 provide protection and current limiting. | EXTRA PORTS (JST-PH) | C11 & C12 filter AVCC, / isolated via FB1. | 2MB QSPI FLASH | BABEL FLASH CHIP | U4 is another GD25Q16C Flash / chip, this tied to the SAMD51's / dedicated QSPI bus (D35-D40); / it's the CIRCUITPY drive that / shows up when you plug it in! / R9 pulls U4's CS high; the / microcontroller can drive it / low (active) via QSPI_CS (D36). | U6 is a GD25Q16C Flash / memory chip on the main / SPI bus (CS: D52). It stores / Unicode character data and / Unifont glyphs for every code / point in the Basic Multliingual / Plane. Contents covered by GPL / with font embedding exception. | SWDIO | GND | 3V3 | SWCLK | RESET | An SWD connector / and test points / allow access to / the serial wire / debug interface. / R5=SWCLK pullup | COLOPHON | The Open Book by Joey Castillo / @josecastillo. Based in large part / on @Adafruit's great open source / designs. OSO Logo & lazer bear / by Joseph Devens, @DoctorDevens. / Thanks to Josh L, Tom F, Brent R. / Thanks to 20 years of volunteers / behind GNU Unifont: Unifoundry.com. / Crafted with . in Brooklyn & Texas. | DEBUG PORT | BUTTON REGISTER | AUDIO COMBO JACK | U5 is a 74165 8-bit / shift register. It takes / the state of the board's / 8 buttons (L/D/U/R/Sel/ / Prev/Next/Lock) and fits / them in a single byte that we can read / via.. | 3.5mm jack J1 does / a lot! Dual DACs on / A0 and A1 drive the / R and L channels, / respectively. If your / earphones have an / inline mic, you can / read that signal on / pin A7. And if it has / a one button remote | ENABLE SWITCH | R1 up top pulls EN / high. SW1 pulls EN / low when switched, / disabling 3V power / supply U1& / most of the / board. | A thru-hole Neopixel / (D8) is useful to show / CircuitPython status, / or you can use it for / general blinkenlights. | STATUS LED | ...clock D48, data / D49 & latch D50. / Lock also on D51. | not a PWM RGB LED! This: / https://adafru.it/1938 / Data pin at right, / power is higher of / VBAT and VBUS. | RESET SWITCH | R6 pulls reset / high. BTN_RESET / pulls it low. C13 / is a filter cap / and R7 limits / current spike as / C13 discharges. | Bits: / 0: LEFT / 1: DOWN / 2: UP / 3: RIGHT / 4: SEL / 5: PREV / 6: NEXT / 7: LOCK | (like the old iPhone / ones) you can detect / button presses / when A7 shorts / to ground. | BTN_RESET
tStop: THE OPEN BOOK